# Altium schematic sheet ESP_82661.SchDoc
size 431 x 279 mm
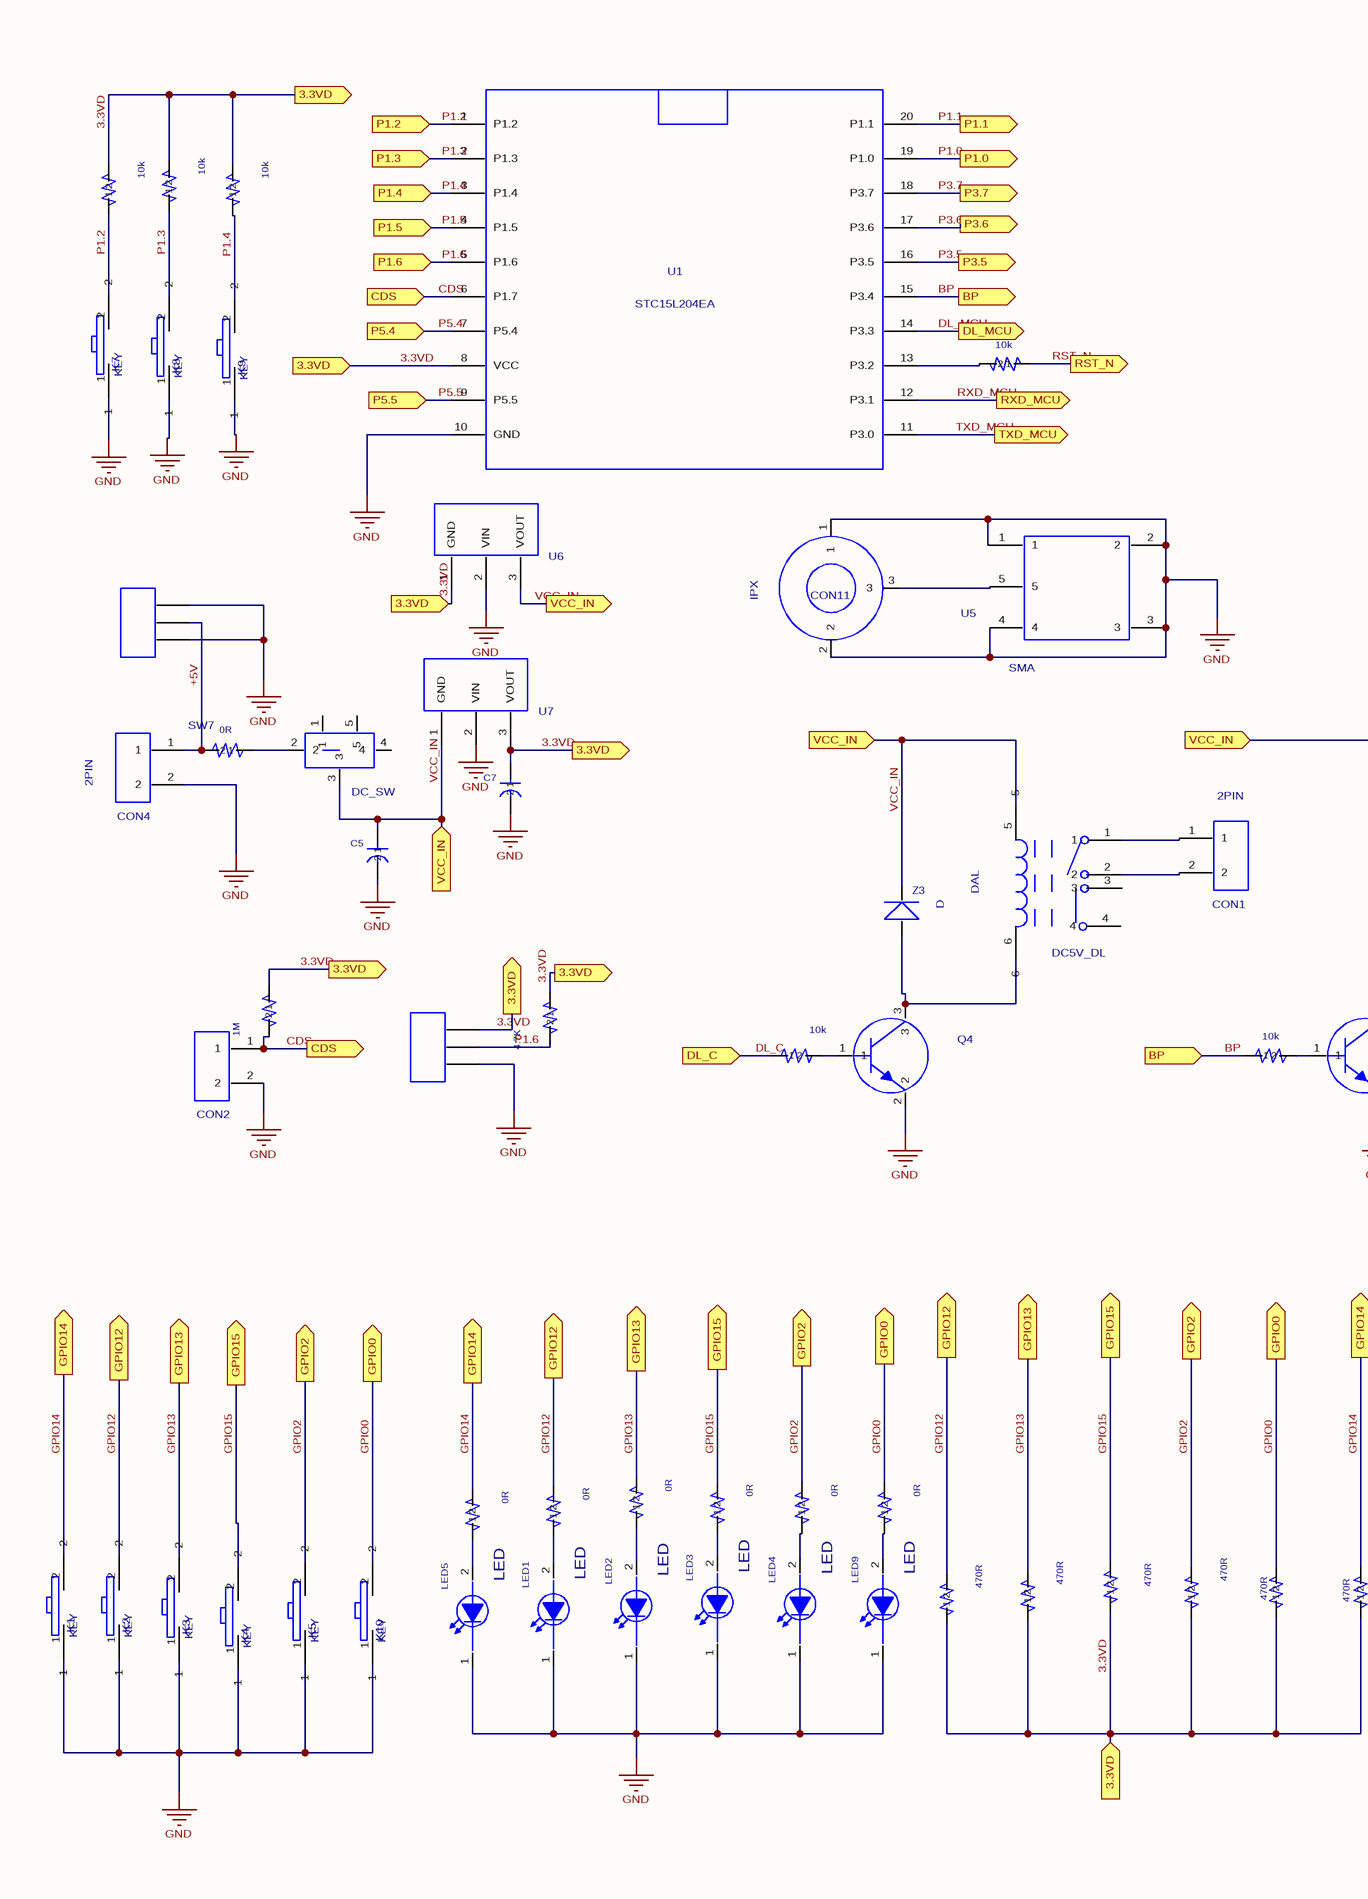
[diagram p0: ESP_82661.SchDoc, left]
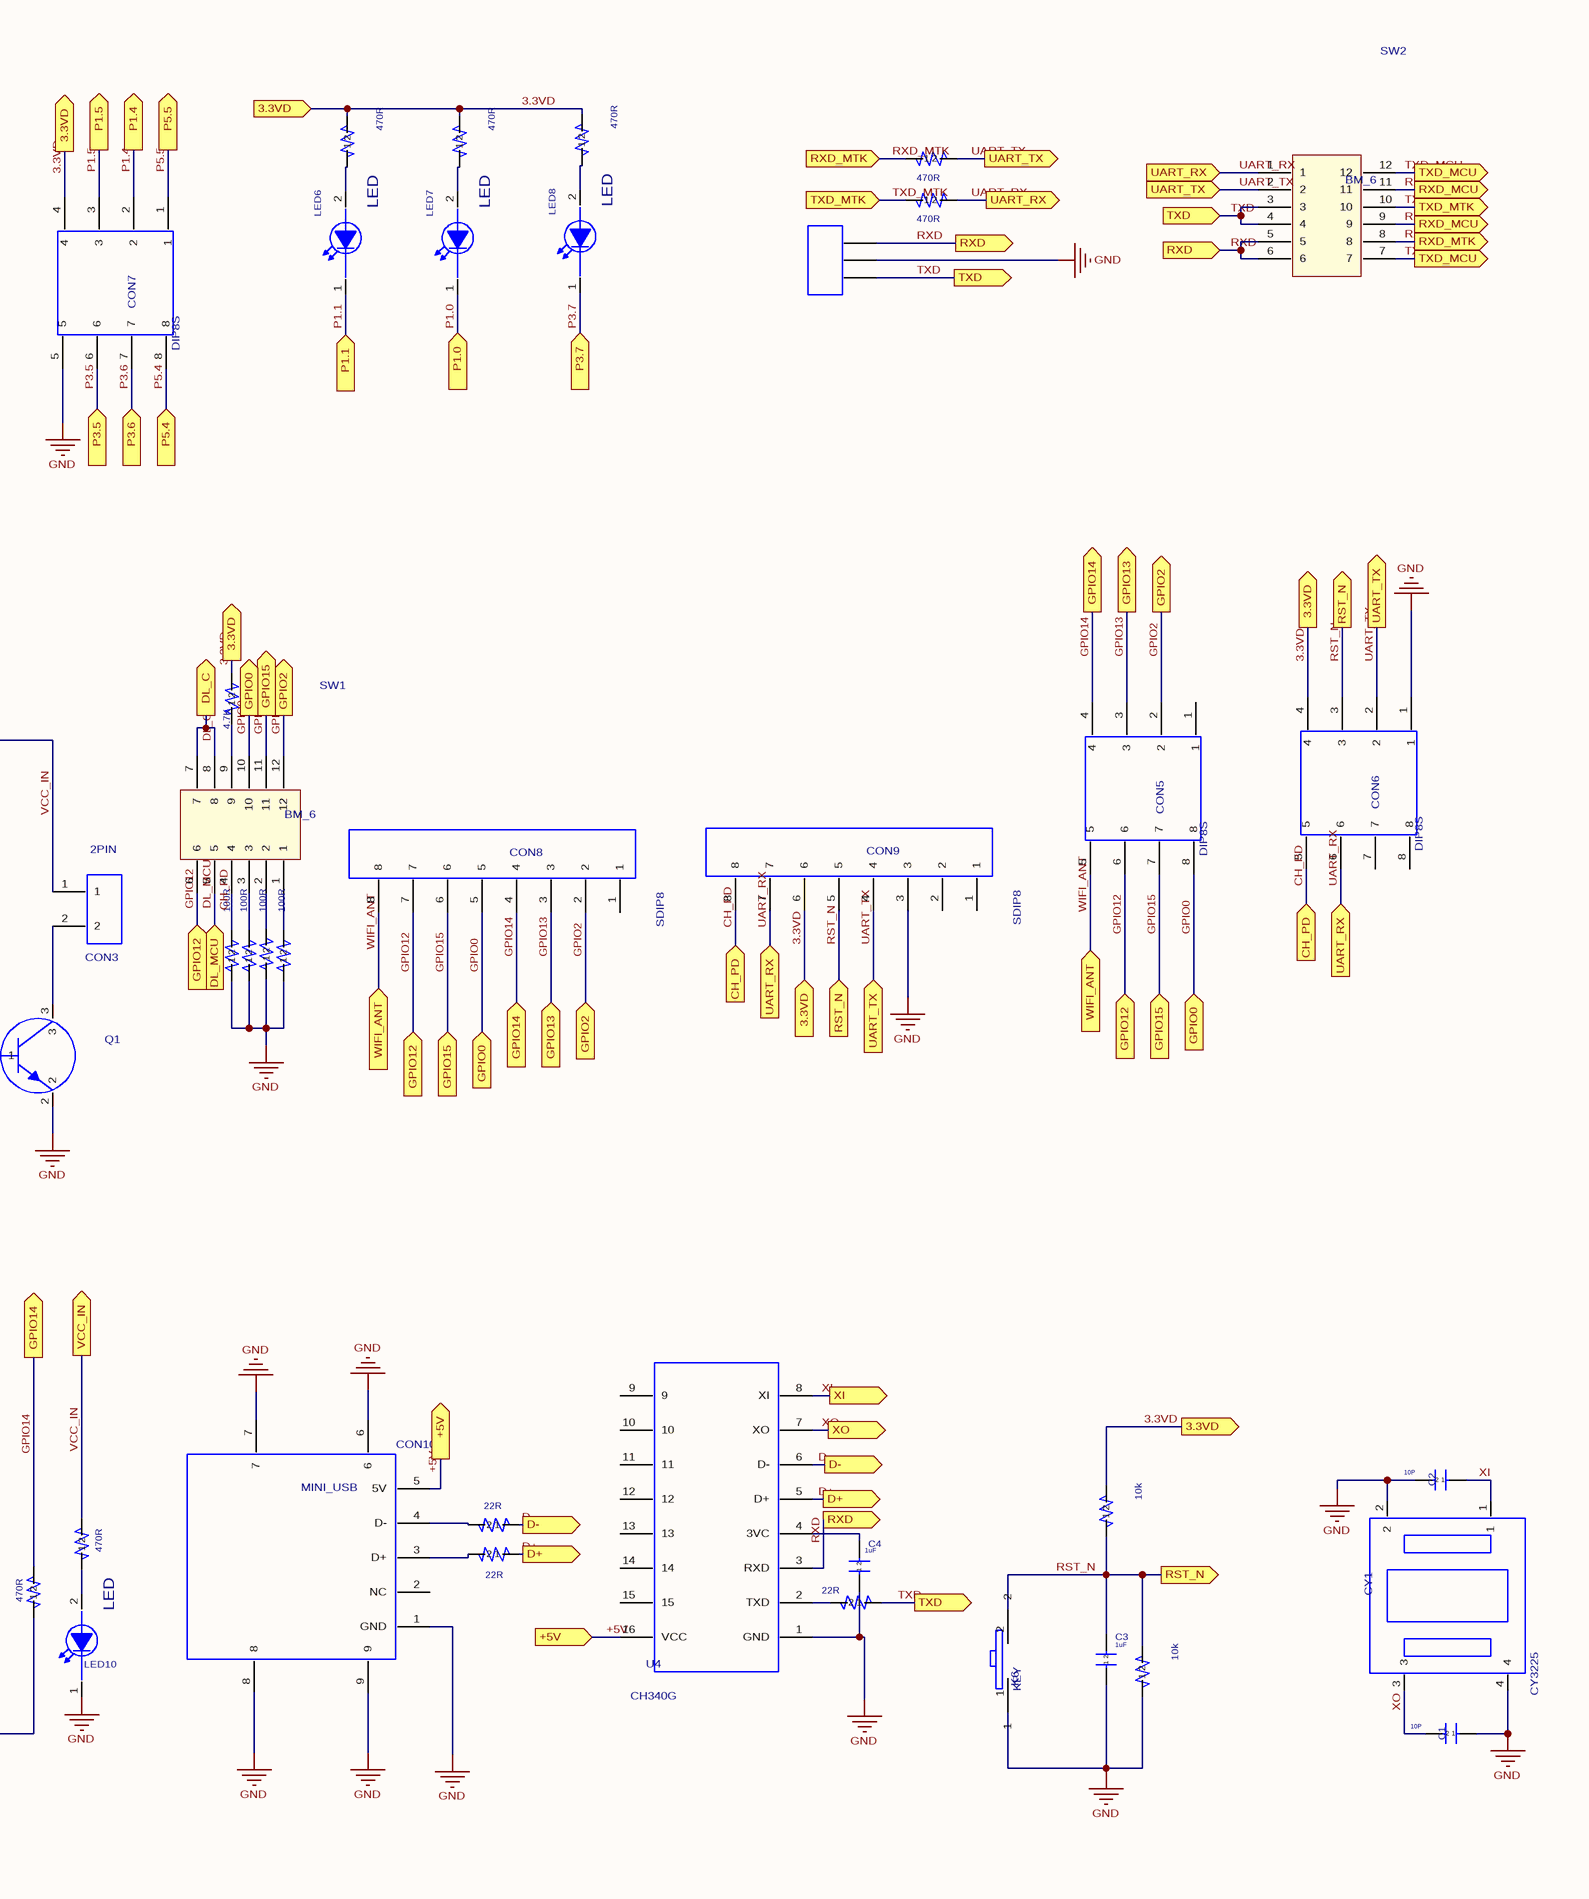
[diagram p1: ESP_82661.SchDoc, right]

## Parts
C1  value 10P  [C0805/0603]  (hidden comment: CAP)
C2  value 10P  [C0805/0603]  (hidden comment: CAP)
C3  value 1uF  [C0805/0603]  (hidden comment: CAP)
C4  value 1uF  [C0805/0603]  (hidden comment: CAP)
C5  ECAP  [EC-10]  (value not drawn)
C7  ECAP  [EC]  (value not drawn)
CON1  2PIN  [AC2P]
CON2  2PIN  [2PIN]  (value not drawn)
CON3  2PIN  [BEEP]
CON4  2PIN  [2PIN]
CON5  DIP8S  [DIP8]
CON6  DIP8S  [DIP8]
CON7  DIP8S  [DIP8]
CON8  SDIP8  [SDIP8]
CON9  SDIP8  [SDIP8]
CON10  MINI_USB  [MINUSB]
CON11  IPX  [IPX]
CY1  CY3225  [CRYS/SMD/2.0X2.5/CXA-04000-2F3F40]
DC5V_DL  DAL  [JDQ]
K1  KEY  [QCKG]
K2  KEY  [QCKG]
K3  KEY  [QCKG]
K4  KEY  [QCKG]
K5  KEY  [QCKG]
K6  KEY  [QCKG]
K7  KEY  [QCKG]
K8  KEY  [QCKG]
K9  KEY  [QCKG]
K10  KEY  [QCKG]
LED1  LED  [0603]
LED2  LED  [0603]
LED3  LED  [0603]
LED4  LED  [0603]
LED5  LED  [0603]
LED6  LED  [0603]
LED7  LED  [0603]
LED8  LED  [0603]
LED9  LED  [0603]
LED10  LED  [0603]
Q1  2N3904  [SOT23]  (value not drawn)
Q4  2N3904  [SOT23]  (value not drawn)
R1  value 470R  [R0805/0603]  (hidden comment: RES)
R2  value 0R  [R0805/0603]  (hidden comment: RES)
R3  value 0R  [R0805/0603]  (hidden comment: RES)
R4  value 0R  [R0805/0603]  (hidden comment: RES)
R5  value 470R  [R0805/0603]  (hidden comment: RES)
R6  value 0R  [R0805/0603]  (hidden comment: RES)
R7  value 0R  [R0805/0603]  (hidden comment: RES)
R8  value 470R  [R0805/0603]  (hidden comment: RES)
R9  value 470R  [R0805/0603]  (hidden comment: RES)
R10  value 470R  [R0805/0603]  (hidden comment: RES)
R11  value 470R  [R0805/0603]  (hidden comment: RES)
R12  value 470R  [R0805/0603]  (hidden comment: RES)
R13  value 10k  [R0805/0603]  (hidden comment: RES)
R14  value 10k  [R0805/0603]  (hidden comment: RES)
R15  value 470R  [R0805/0603]  (hidden comment: RES)
R16  value 22R  [R0805/0603]  (hidden comment: RES)
R17  value 22R  [R0805/0603]  (hidden comment: RES)
R18  value 22R  [R0805/0603]  (hidden comment: RES)
R19  value 10k  [R0805/0603]  (hidden comment: RES)
R20  value 0R  [R0805/0603]  (hidden comment: RES)
R21  value 1M  [R0805/0603]  (hidden comment: RES)
R22  value 10k  [R0805/0603]  (hidden comment: RES)
R23  value 10k  [R0805/0603]  (hidden comment: RES)
R24  value 0R  [R0805/0603]  (hidden comment: RES)
R25  value 470R  [R0805/0603]  (hidden comment: RES)
R26  value 470R  [R0805/0603]  (hidden comment: RES)
R27  value 470R  [R0805/0603]  (hidden comment: RES)
R28  value 470R  [R0805/0603]  (hidden comment: RES)
R29  value 10k  [R0805/0603]  (hidden comment: RES)
R30  value 10k  [R0805/0603]  (hidden comment: RES)
R31  value 10k  [R0805/0603]  (hidden comment: RES)
R32  value 100R  [R0805/0603]  (hidden comment: RES)
R33  value 100R  [R0805/0603]  (hidden comment: RES)
R34  value 100R  [R0805/0603]  (hidden comment: RES)
R35  value 100R  [R0805/0603]  (hidden comment: RES)
R37  value 4.7K  [R0805/0603]  (hidden comment: RES)
R38  value 4.7K  [R0805/0603]  (hidden comment: RES)
SW1  BM_6  [BM_6_DEC]
SW2  BM_6  [BM_6_DEC]
SW7  DC_SW  [DC_SW]
U1  STC15L204EA  [SOP20]
U2  3PIN  [3PIN]  (value not drawn)
U3  3PIN  [DC_CON8]  (value not drawn)
U4  CH340G  [SO16MB]
U5  SMA  [SMA]
U6  HT71XX  [SOT223]  (value not drawn)
U7  HT71XX  [SOT89]  (value not drawn)
U8  3PIN  [3PIN]  (value not drawn)
Z3  D  [DIDO-1]

## Ports
3.3VD, +5V, BP, CDS, CH_PD, D+, D-, DL_C, DL_MCU, GPIO0, GPIO2, GPIO12, GPIO13, GPIO14, GPIO15, P1.0, P1.1, P1.2, P1.3, P1.4, P1.5, P1.6, P3.5, P3.6, P3.7, P5.4, P5.5, RST_N, RXD, RXD_MCU, RXD_MTK, TXD, TXD_MCU, TXD_MTK, UART_RX, UART_TX, VCC_IN, WIFI_ANT, XI, XO

## Nets
GND: C1.2 C2.1 C3.2 C4.2 C5.1 C7.1 CON2.2 CON4.2 CON6.1 CON7.5 CON9.3 CON10.1(GND) CON10.6 CON10.7 CON10.8 CON10.9 CON11.1 CON11.2 CY1.2 CY1.4 LED1.1(CATHODE) LED2.1(CATHODE) LED3.1(CATHODE) LED4.1(CATHODE) LED5.1(CATHODE) LED9.1(CATHODE) LED10.1(CATHODE) Q1.2 Q4.2 R19.2 R32.2 R33.2 R34.2 R35.2 U1.10(GND) U2.2 U3.1 U3.3 U4.1(GND) U5.1 U5.2 U5.3 U5.4 U6.2(VIN) U7.2(VIN) U8.3
3.3VD: C7.2 CON6.4 CON7.4 CON9.6 R8.2 R9.2 R10.2 R11.2 R12.2 R13.1 R21.2 R25.1 R26.1 R27.1 R28.2 R29.1 R30.1 R31.1 R37.2 R38.1 U1.8(VCC) U6.1(GND) U7.3(VOUT) U8.1 ; port 3.3VD
+5V: CON4.1 CON10.5(5V) R24.1 U3.2 U4.16(VCC) ; port +5V
BP: R23.2 U1.15(P3.4) ; port BP
CDS: CON2.1 R21.1 U1.6(P1.7) ; port CDS
CH_PD: CON6.5 CON9.8 R35.1 SW1.4 ; port CH_PD
D+: R17.2 U4.5(D+) ; port D+
D-: R16.2 U4.6(D-) ; port D-
DL_C: R22.2 SW1.7 SW1.8 ; port DL_C
DL_MCU: SW1.5 U1.14(P3.3) ; port DL_MCU
GPIO0: CON5.8 CON8.5 R12.1 R20.1 SW1.10 ; port GPIO0
GPIO2: CON5.2 CON8.2 R7.1 R11.1 SW1.12 ; port GPIO2
GPIO12: CON5.6 CON8.7 R3.1 R8.1 SW1.6 ; port GPIO12
GPIO13: CON5.3 CON8.3 R4.1 R9.1 ; port GPIO13
GPIO14: CON5.4 CON8.4 R2.1 R28.1 ; port GPIO14
GPIO15: CON5.7 CON8.6 R6.1 R10.1 SW1.11 ; port GPIO15
P1.0: LED7.1(CATHODE) U1.19(P1.0) ; port P1.0
P1.1: LED6.1(CATHODE) U1.20(P1.1) ; port P1.1
P1.2: R29.2 U1.1(P1.2) ; port P1.2
P1.3: R30.2 U1.2(P1.3) ; port P1.3
P1.4: CON7.2 R31.2 U1.3(P1.4) ; port P1.4
P1.5: CON7.3 U1.4(P1.5) ; port P1.5
P1.6: R37.1 U1.5(P1.6) U8.2 ; port P1.6
P3.5: CON7.6 U1.16(P3.5) ; port P3.5
P3.6: CON7.7 U1.17(P3.6) ; port P3.6
P3.7: LED8.1(CATHODE) U1.18(P3.7) ; port P3.7
P5.4: CON7.8 U1.7(P5.4) ; port P5.4
P5.5: CON7.1 U1.9(P5.5) ; port P5.5
RST_N: C3.1 CON6.3 CON9.5 R13.2 R14.2 R19.1 ; port RST_N
RXD: SW2.5 SW2.6 U2.1 U4.3(RXD) ; port RXD
RXD_MCU: SW2.9 SW2.11 U1.12(P3.1) ; port RXD_MCU
RXD_MTK: R5.2 SW2.8 ; port RXD_MTK
TXD: R18.2 SW2.3 SW2.4 U2.3 ; port TXD
TXD_MCU: SW2.7 SW2.12 U1.11(P3.0) ; port TXD_MCU
TXD_MTK: R1.2 SW2.10 ; port TXD_MTK
UART_RX: CON6.6 CON9.7 R1.1 SW2.1 ; port UART_RX
UART_TX: CON6.2 CON9.4 R5.1 SW2.2 ; port UART_TX
VCC_IN: C5.2 CON3.1 R15.1 SW7.3 U6.3(VOUT) U7.1(GND) Z3.2 ; port VCC_IN
WIFI_ANT: CON5.5 CON8.8 ; port WIFI_ANT
XI: C2.2 CY1.1 U4.8(XI) ; port XI
XO: C1.1 CY1.3 U4.7(XO) ; port XO
NetC4_1: C4.1 U4.4(3VC)
NetCON1_1: CON1.1 DC5V_DL.1
NetCON1_2: CON1.2 DC5V_DL.2
NetCON3_2: CON3.2 Q1.3
NetCON10_3: CON10.3(D+) R17.1
NetCON10_4: CON10.4(D-) R16.1
NetCON11_3: CON11.3 U5.5
NetLED1_2: LED1.2(ANODE) R3.2
NetLED2_2: LED2.2(ANODE) R4.2
NetLED3_2: LED3.2(ANODE) R6.2
NetLED4_2: LED4.2(ANODE) R7.2
NetLED5_2: LED5.2(ANODE) R2.2
NetLED6_2: LED6.2(ANODE) R25.2
NetLED7_2: LED7.2(ANODE) R26.2
NetLED8_2: LED8.2(ANODE) R27.2
NetLED9_2: LED9.2(ANODE) R20.2
NetLED10_2: LED10.2(ANODE) R15.2
NetQ1_1: Q1.1 R23.1
NetQ4_1: Q4.1 R22.1
NetQ4_3: Q4.3 Z3.1
NetR14_1: R14.1 U1.13(P3.2)
NetR18_1: R18.1 U4.2(TXD)
NetR24_2: R24.2 SW7.2
NetR32_1: R32.1 SW1.1
NetR33_1: R33.1 SW1.2
NetR34_1: R34.1 SW1.3
NetR38_2: R38.2 SW1.9

Not connected (* = marked no-connect by the designer): CON5 1; CON6 7 8; CON8 1; CON9 1 2; CON10 2(NC); DC5V_DL 3 4 5 6; K1 1 2; K2 1 2; K3 1 2; K4 1 2; K5 1 2; K6 1 2; K7 1 2; K8 1 2; K9 1 2; K10 1 2; SW7 1 4 5; U4 9 10 11 12 13 14 15

## Library data of the parts
C1-C4 = CAP: PART DESC: 0603 SMD; PCB DECAL: C0805/0603
C5 C7 = ECAP: PART DESC: 5X11mm; VALUE: 100uF/6.3V
  C5: PCB DECAL: EC-10
  C7: PCB DECAL: EC
LED1-LED10 = LED: Source Path: H:\ORCADLIB\SUNPLUS.OLB; Value: LED; PCB Footprint: LED; PCB DECAL: 0603
Q1 Q4 = 2N3904: SOT23; Value: S8050; PCB DECAL: SOT23; PART DESC: SOT23
R1-R35 R37 R38 = RES: PART DESC: 0603 SMD; PCB DECAL: R0805/0603
U6 U7 = HT71XX: PART DESC: TO-92; Value: HT7533
  U6: PCB DECAL: SOT223
  U7: PCB DECAL: SOT89
Z3 = D: Value: IN4148; PCB DECAL: DIDO-1
CON1-CON4 = 2PIN
  CON1: PCB DECAL: AC2P
  CON2 CON4: PCB DECAL: 2PIN
  CON3: PCB DECAL: BEEP
CON5-CON7 = DIP8S: PCB DECAL: DIP8
CON8 CON9 = SDIP8: PCB DECAL: SDIP8
CON10 = MINI_USB: PCB DECAL: MINUSB
CON11 = IPX: PCB DECAL: IPX
CY1 = CY3225: PCB DECAL: CRYS/SMD/2.0X2.5/CXA-04000-2F3F40
DC5V_DL = DAL: PCB DECAL: JDQ
K1-K10 = KEY: PCB DECAL: QCKG
SW1 SW2 = BM_6: PCB DECAL: BM_6_DEC
SW7 = DC_SW: PCB DECAL: DC_SW
U1 = STC15L204EA: PCB DECAL: SOP20
U2 U3 U8 = 3PIN
  U2 U8: PCB DECAL: 3PIN
  U3: PCB DECAL: DC_CON8
U4 = CH340G: PCB DECAL: SO16MB
U5 = SMA: PCB DECAL: SMA